# Altium schematic sheet ST_LINK_V2-1.SCHDOC: ST-LINK/V2-1 with support of SWD only
size A4; Date: 25-FEB-2015; Author: A.B; CompanyName: STMicroelectronics; Address1: 12, Rue Jules HOROWITZ; Address2: 38019 Grenoble; Address3: FRANCE; DocumentNumber: MB1191; Revision: B-02; SheetNumber: 2; SheetTotal: 13; Project: STM32F746G-DISCO
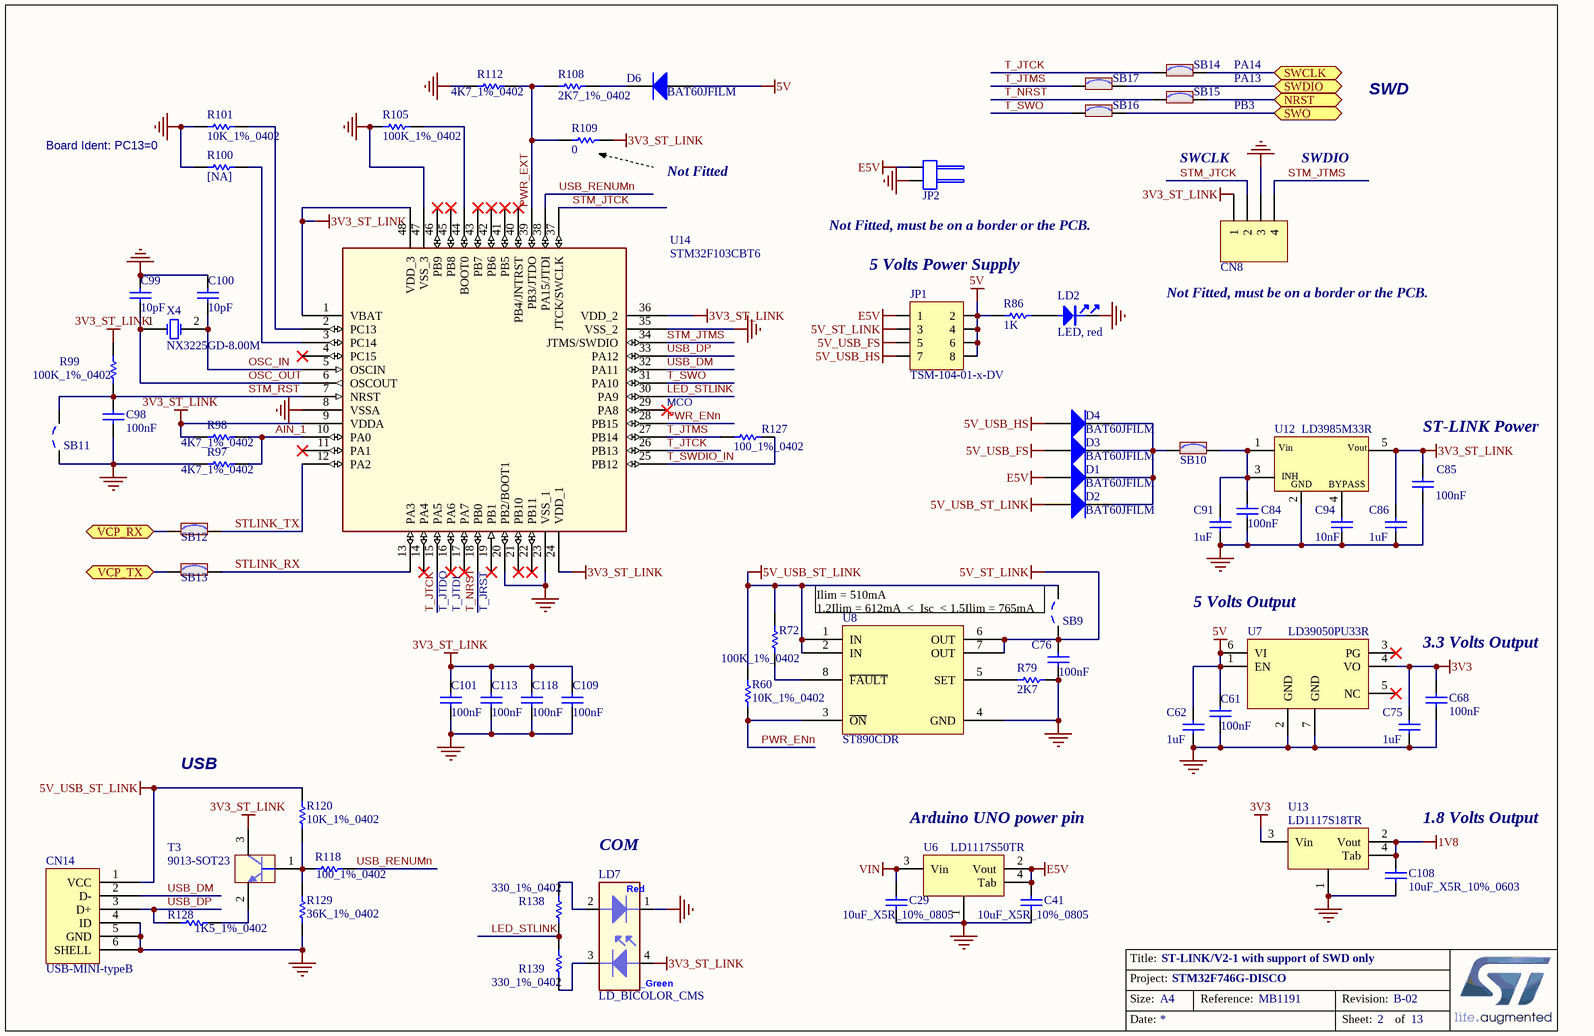
[diagram p0: ST_LINK_V2-1.SCHDOC]

## Parts
C29  10uF_X5R_10%_0805  [0805C]
C41  10uF_X5R_10%_0805  [0805C]
C61  100nF  [0402C]
C62  1uF  [0603C]
C68  100nF  [0402C]
C75  1uF  [0603C]
C76  100nF  [0402C]
C84  100nF  [0402C]
C85  100nF  [0402C]
C86  1uF  [0603C]
C91  1uF  [0603C]
C94  10nF  [0603C]
C98  100nF  [0402C]
C99  10pF  [0402C]
C100  10pF  [0402C]
C101  100nF  [0402C]
C108  10uF_X5R_10%_0603  [0603C]
C109  100nF  [0402C]
C113  100nF  [0402C]
C118  100nF  [0402C]
CN8  Header 4  [Header 4]  (value not drawn)
CN14  USB-MINI-typeB  [USB-MINI-B-SMD]
D1  BAT60JFILM  [SOD323/A]
D2  BAT60JFILM  [SOD323/A]
D3  BAT60JFILM  [SOD323/A]
D4  BAT60JFILM  [SOD323/A]
D6  BAT60JFILM  [SOD323/A]
JP1  TSM-104-01-x-DV  [TSM-104-01-x-DV]
JP2  TSM-102-01-x-SH  [SL_12_SMD_032_2]  (value not drawn)
LD2  LED, red  [0603D]
LD7  LD_BICOLOR_CMS  [HSMF-A201]
R60  10K_1%_0402  [0402R]
R72  100K_1%_0402  [0402R]
R79  2K7  [0402R]
R86  1K  [0402R]
R97  4K7_1%_0402  [0402R]
R98  4K7_1%_0402  [0402R]
R99  100K_1%_0402  [0402R]
R100  [NA]  [0402R]
R101  10K_1%_0402  [0402R]
R105  100K_1%_0402  [0402R]
R108  2K7_1%_0402  [0402R]
R109  0  [0402R]
R112  4K7_1%_0402  [0402R]
R118  100_1%_0402  [0402R]
R120  10K_1%_0402  [0402R]
R127  100_1%_0402  [0402R]
R128  1K5_1%_0402  [0402R]
R129  36K_1%_0402  [0402R]
R138  330_1%_0402  [0402R]
R139  330_1%_0402  [0402R]
SB9  Solder Bridge OFF  [JP2_SMD]  (value not drawn)
SB10  Solder Bridge ON  [JP2_SMD]  (value not drawn)
SB11  Solder Bridge OFF  [JP2_SMD]  (value not drawn)
SB12  Solder Bridge ON  [JP2_SMD]  (value not drawn)
SB13  Solder Bridge ON  [JP2_SMD]  (value not drawn)
SB14  Solder Bridge ON  [JP2_SMD]  (value not drawn)
SB15  Solder Bridge ON  [JP2_SMD]  (value not drawn)
SB16  Solder Bridge ON  [JP2_SMD]  (value not drawn)
SB17  Solder Bridge ON  [JP2_SMD]  (value not drawn)
T3  9013-SOT23  [SOT23]
U6  LD1117S50TR  [SOT-223]
U7  LD39050PU33R  [DFN6_3x3]
U8  ST890CDR  [SO-8]
U12  LD3985M33R  [SOT-23-5L]
U13  LD1117S18TR  [SOT-223]
U14  STM32F103CBT6  [QFP48 7x7]
X4  NX3225GD-8.00M  [XTAL_2SM_3R2X2R5]

## Ports
NRST, SWCLK, SWDIO, SWO, VCP_RX, VCP_TX

## Nets
1V8: C108.2 U13.2(Vout) U13.4(Tab)
3V3: C68.2 C75.2 U7.4(VO) U13.3(Vin)
3V3_ST_LINK: C85.2 C86.1 C101.2 C109.2 C113.2 C118.1 CN8.1 LD7.4 R98.1 R99.2 R109.2 T3.3(C) U12.5(Vout) U14.1(VBAT) U14.9(VDDA) U14.24(VDD_1) U14.36(VDD_2) U14.48(VDD_3)
5V: C61.2 C62.2 D6.1(A) JP1.2 JP1.4 JP1.6 JP1.8 R86.1 U7.1(EN) U7.6(VI)
5V_ST_LINK: C76.2 JP1.3 SB9.1 U8.6(OUT) U8.7(OUT)
5V_USB_FS: D3.1(A) JP1.5
5V_USB_HS: D4.1(A) JP1.7
5V_USB_ST_LINK: CN14.1(VCC) D2.1(A) R60.2 R72.2 R120.2 SB9.2 U8.1(IN) U8.2(IN)
E5V: C41.2 D1.1(A) JP1.1 JP2.1(COMMON) U6.2(Vout) U6.4(Tab)
GND: C29.1 C41.1 C61.1 C62.1 C68.1 C75.1 C76.1 C84.1 C85.1 C86.2 C91.1 C94.1 C98.1 C99.1 C100.1 C101.1 C108.1 C109.1 C113.1 C118.2 CN8.3 CN14.4(ID) CN14.5(GND) CN14.6(SHELL) JP2.2(NO) LD2.2 LD7.1 R79.2 R97.1 R100.1 R101.1 R105.1 R112.1 R129.1 SB11.1 U6.1 U7.2(GND) U7.7(GND) U8.4(GND) U12.2(GND) U13.1 U14.8(VSSA) U14.20(PB2/BOOT1) U14.23(VSS_1) U14.35(VSS_2) U14.47(VSS_3)
VIN: C29.2 U6.3(Vin)
AIN_1: R97.2 R98.2 U14.10(PA0)
LED_STLINK: R138.1 R139.2 U14.30(PA9)
NRST: SB15.2 ; port NRST
OSC_IN: C100.2 U14.5(OSCIN) X4.2(OSC2)
OSC_OUT: C99.2 U14.6(OSCOUT) X4.1(OSC1)
PWR_ENn: R60.1 U8.3(~{ON}) U14.28(PB15)
PWR_EXT: R108.1 R109.1 R112.2 U14.39(PB3/JTDO)
STLINK_RX: SB13.2 U14.13(PA3)
STLINK_TX: SB12.2 U14.12(PA2)
STM_JTCK: CN8.2 U14.37(JTCK/SWCLK)
STM_JTMS: CN8.4 U14.34(JTMS/SWDIO)
STM_RST: C98.2 R99.1 SB11.2 U14.7(NRST)
SWCLK: SB14.2 ; port SWCLK
SWDIO: SB17.2 ; port SWDIO
SWO: SB16.2 ; port SWO
T_JTCK: SB14.1 U14.15(PA5) U14.26(PB13)
T_JTMS: R127.1 SB17.1 U14.27(PB14)
T_NRST: SB15.1 U14.18(PB0)
T_SWDIO_IN: R127.2 U14.25(PB12)
T_SWO: SB16.1 U14.31(PA10)
USB_DM: CN14.2(D-) U14.32(PA11)
USB_DP: CN14.3(D+) R128.1 U14.33(PA12)
USB_RENUMn: R118.2 U14.38(PA15/JTDI)
VCP_RX: SB12.1 ; port VCP_RX
VCP_TX: SB13.1 ; port VCP_TX
NetC84_2: C84.2 C91.2 SB10.2 U12.1(Vin) U12.3(CE)
NetC94_2: C94.2 U12.4(BYPASS)
NetD1_2: D1.2(K) D2.2(K) D3.2(K) D4.2(K) SB10.1
NetD6_2: D6.2(K) R108.2
NetLD2_1: LD2.1 R86.2
NetLD7_2: LD7.2 R138.2
NetLD7_3: LD7.3 R139.1
NetR72_1: R72.1 U8.8(~{FAULT})
NetR79_1: R79.1 U8.5(SET)
NetR100_2: R100.2 U14.3(PC14)
NetR101_2: R101.2 U14.2(PC13)
NetR105_2: R105.2 U14.44(BOOT0)
NetR118_1: R118.1 R120.1 R129.2 T3.1(B)
NetR128_2: R128.2 T3.2(E)

Not connected (* = marked no-connect by the designer): U7 3(PG)* 5(NC)*; U14 4(PC15)* 11(PA1)* 14(PA4)* 16(PA6)* 17(PA7)* 19(PB1)* 21(PB10)* 22(PB11)* 29(PA8)* 40(PB4/JNTRST)* 41(PB5)* 42(PB6)* 43(PB7)* 45(PB8)* 46(PB9)*

## Notes on the sheet
- PA14
- PA13
- PB3
- SWD
- Board Ident: PC13=0
- Not Fitted
- SWCLK
- SWDIO
- (near JP2) Not Fitted, must be on a border or the PCB.
- 5 Volts Power Supply
- Not Fitted, must be on a border or the PCB.
- MCO
- ST-LINK Power
- (near U14) T_JTDO
- (near U14) T_JTDI
- (near U14) T_JRST
- (near SB9) Ilim = 510mA
  1.2Ilim = 612mA  <  Isc  < 1.5Ilim = 765mA
- 5 Volts Output
- 3.3 Volts Output
- USB
- COM
- (near U6) Arduino UNO power pin
- 1.8 Volts Output
- Title:
- Project:
- Size:
- Date:
- A4
- Reference:
- Sheet:
- Revision:
- of
- (in symbol LD3985M33R) INH
- (in symbol LD_BICOLOR_CMS) Red; _Green

## Library data of the parts
C29 C41 = Cap_10uF_X5R_10%_0805: Capacitor,10uF,25V,X5R,10%,0805,YAGEO; Manuf_Part_1: CC0805KRX5R8BB106; Revision: July-2002: Re-released for DXP Platform.; Value: 10uF; Order: CC0805KRX5R8BB106; Manuf_1: YAGEO; ECCN_US/EU: n/a
C61 C68 C76 C84 C85 C98 C101 C109 C113 C118 = Cap_100nF_X7R_10%_0402: Capacitor,100nF,16V,X7R,10%,0402,YAGEO; Manuf_Part_1: CC0402KRX7R7BB104; Revision: July-2002: Re-released for DXP Platform.; Value: 100nF; Order: CC0402KRX7R7BB104; Manuf_1: YAGEO
C62 C75 C86 C91 = Cap_1uF_X5R_10%_0603: Capacitor,1uF,16V,X5R,10%,0603,YAGEO; Manuf_Part_1: CC0603KRX5R7BB105; Revision: July-2002: Re-released for DXP Platform.; Value: 1uF; Order: CC0603KRX5R7BB105; Manuf_1: YAGEO
C94 = Cap_10nF_X7R_10%_0603: Capacitor,10nF,50V,X7R,10%,0603,YAGEO; Manuf_Part_1: CC0603KRX7R9BB103; Revision: July-2002: Re-released for DXP Platform.; Value: 10nF; Order: CC0603KRX7R9BB103; Manuf_1: YAGEO
C99 C100 = Cap_10pF_NPO_5%_0402: Capacitor,10pF,50V,NPO,5%,0402,YAGEO; Order: CC0402JRNPO9BN100; Revision: July-2002: Re-released for DXP Platform.; Value: 10pF; Manuf_1: YAGEO; Manuf_Part_1: CC0402JRNPO9BN100; ECCN_US/EU: n/a
C108 = Cap_10uF_X5R_10%_0603: Capacitor,10uF,6.3V,X5R,10%,0603,YAGEO; Manuf_Part_1: CC0603KRX5R5BB106; Revision: July-2002: Re-released for DXP Platform.; Value: 10uF; Order: CC0603KRX5R5BB106; Manuf_1: YAGEO; ECCN_US/EU: n/a
CN8 = Header 4: Header, 4-Pin; Fitted: NO; Revision: 17-Jul-2002: Re-released for DXP Platform.; Publisher: Altium Limited; ECCN_US/EU: n/a
CN14 = USB-MINI-typeB connector: Manuf_Part_1: 5075BMR-05-SM; Manuf_Part_2: 218205M1110T; Manuf_2: lyconn; Manuf_Part_3: MUSB5QS-BM1H6-NLB-E; Manuf_3: TOWNES; Description: USB,MINI-USB-5P/F, 5075BMR-05-M; ECCN_US/EU: n/a
D1-D4 D6 = BAT60JFILM: Manuf_1: STM; Provided: ST; ECCN_US/EU: EAR99/NEC; Ref St: 9151097; Revision: July-2002: Re-released for DXP Platform.; Order: BAT60JFILM; Manuf_Part_1: BAT60JFILM; Distrib: ST
JP1 = Header_4X2_SMD: Header, 4-Pins, Double row Vertical, SMD, 2.54; Manuf_1: SAMTEC; Manuf_Part_1: TSM-104-01-x-DV; ECCN_US/EU: n/a
JP2 = JP2_CMS: Header, 2-Pins, Single row Horizontal SMD, 2.54; Manuf_1: SAMTEC; Manuf_Part_2: SL 12 SMD 032 2 Z B TR; Manuf_2: Fisher Elektronik; Manuf_Part_3: P1014-1*02VGF-129-1A; Manuf_3: TOWNES; ECCN_US/EU: n/a; Manuf_Part_1: TSM-102-01-x-SH
LD2 = LED_red: LED, red, 0603; Manuf_1: everlight; Manuf_Part_1: 19-213-R6C-AP1Q2B/3T; Description: LED,red,0603,19-213-R6C-AP1Q2B/3T,everlight; ECCN_US/EU: EAR99/NEC; Order: 19-213-R6C-AP1Q2B/3T
LD7 = LD_BICOLOR_CMS: Bicolor Led; Manuf_Part_1: HSMF-A201-A00J1; Manuf_1: Avago Technologies; Manuf_2: everluck; Manuf_Part_2: LE-RGW35280; Ref St: xxxxxx; ECCN_US/EU: EAR99/NEC; Distrib: RADIOSPARES
R60 R101 R120 = Res_10K_1%_0402: Resistor,10K,0402,1%,YAGEO; Manuf_Part_1: RC0402FR-0710KL; Value: 10K; Manuf_1: YAGEO; Order: RC0402FR-0710KL; ECCN_US/EU: n/a
R72 R99 R105 = Res_100K_1%_0402: Resistor,100K,0402,1%,YAGEO; Manuf_Part_1: RT0402FRE07100KL; Value: 100K; Manuf_1: YAGEO; Order: RT0402FRE07100KL; ECCN_US/EU: n/a
R79 R108 = Res_2K7_1%_0402: Resistor,2K7,0402,1%,YAGEO; Manuf_Part_1: RC0402FR-072K7L; Value: 2K7; Manuf_1: YAGEO; Order: RC0402FR-072K7L; ECCN_US/EU: n/a; Distrib: FARNELL
R86 = Res_1K_1%_0402: Resistor,1K,0402,1%,YAGEO; Manuf_Part_1: RC0402FR-071KL; Value: 1K; Manuf_1: YAGEO; Order: RC0402FR-071KL; ECCN_US/EU: n/a
R97 R98 R112 = Res_4K7_1%_0402: Resistor,4K7,0402,1%,YAGEO; Manuf_Part_1: RT0402FRE074K7L; Value: 4K7; Manuf_1: YAGEO; Order: RT0402FRE074K7L; ECCN_US/EU: n/a
R100 = Res_NA_0402: Resistor,[NA],0402; Fitted: NO; Value: [NA]; ECCN_US/EU: n/a
R109 = Res_0_5%_0402: Resistor,0,0402,5%,YAGEO; Manuf_Part_1: RC0402JR-070RL; Order: 2363467; Fitted: NO; Value: 0; ECCN_US/EU: n/a; Manuf_1: YAGEO; Distrib: FARNELL
R118 R127 = Res_100_1%_0402: Resistor,100,0402,1%,YAGEO; Manuf_Part_1: RC0402FR-07100RL; Value: 100; Order: 9239111; Manuf_1: YAGEO; ECCN_US/EU: n/a; Distrib: FARNELL
R128 = Res_1K5_1%_0402: Resistor,1K5,0402,1%,YAGEO; Manuf_Part_1: RC0402FR-071K5L; Value: 1K5; Manuf_1: YAGEO; Order: RC0402FR-071K5L; ECCN_US/EU: n/a; Distrib: FARNELL
R129 = Res_36K_1%_0402: Resistor,36K,0402,1%,YAGEO; Manuf_Part_1: RC0402FR-0736KL; Value: 36K; Manuf_1: YAGEO; Order: RC0402FR-0736KL; ECCN_US/EU: n/a; Distrib: FARNELL
R138 R139 = Res_330_1%_0402: Resistor,330,0402,1%,YAGEO; Manuf_Part_1: RC0402FR-07330RL; Value: 330; ECCN_US/EU: n/a; Manuf_1: YAGEO; Distrib: DIGIKEY; Order: RC0402FR-07330RL
SB9 SB11 = SB_OFF: Solder: NO; Revision: July-2002: Re-released for DXP Platform.; ECCN_US/EU: n/a
SB10 SB12-SB17 = SB_ON: Solder: YES; Revision: July-2002: Re-released for DXP Platform.; ECCN_US/EU: n/a
T3 = 9013-SOT23: NPN Bipolar Transistor; Manuf_1: NXP; Manuf_Part_1: BSR14; Description: NPN Bipolar Transistor, SOT-23 Footprint; Order: 1081310; ECCN_US/EU: EAR99/NEC; Revision: July-2002: Re-released for DXP Platform.; Distrib: FARNELL
U6 = LD1117S50TR: IC REG LDO 5V 0.8A SOT223; Manuf_1: STM; Ordered by: ST; ECCN_US/EU: EAR99/NEC; Ref St: 9176133; Manuf_Part_1: LD1117S50TR; Distrib: ST; Order: LD1117S50TR; Provided: ST
U7 = LD39050P: Ultra low drop-low , 500 mA low quiescent current; Manuf_1: STM; Provided: ST; ECCN_US/EU: EAR99/NEC; Ref St: xxxxxxxx; Distrib: ST; Manuf_Part_1: LD39050PU33R; Order: LD39050PU33R
U8 = ST890CDR: 1.2 A current limited high-side power switch with thermal shutdown; Manuf_1: STM; ECCN_US/EU: EAR99/NEC; Provided: ST; Manuf_Part_1: ST890CDR; Distrib: ST
U12 = LD3985M33R: Ultra low drop-low noise BiCMOS voltage, regulators low ESR capacitors compatible; Manuf_1: STM; Provided: ST; Ref St: 9176161; ECCN_US/EU: EAR99/NEC; Manuf_Part_1: LD3985M33R; Distrib: ST; Order: LD3985M33R
U13 = LD1117S18TR: LOW DROP FIXED AND ADJUSTABLE POSITIVE VOLTAGE REGULATORS (1.8 Volts); Manuf_1: STM; Ref St: 9176180; ECCN_US/EU: EAR99/NEC; Provided: ST; Manuf_Part_1: LD1117S18TR; Order: LD1117S18TR; Distrib: ST
U14 = STM32F103CBT6: Medium-density performance line ARM-based 32-bit MCU with 128KB Flash; Manuf_1: STM; Ref St: xxxxxxxx; Provided: ST; ECCN_US/EU: 3A991A2/NEC; Footprint: QFP48 7X7; Manuf_Part_1: STM32F103CBT6; Order: STM32F103CBT6; Distrib: ST
X4 = XTAL_8M_NX3225GD: Crystal 8Mhz, 8pF, -+50PPM, SMD; Manuf_1: NDK; Manuf_Part_1: NX3225GD 8MHz EXS00A-CG04874; Manuf_Part_2: NX3225GD-8.000M-STD-CRA-3; ECCN_US/EU: EAR99/NEC; NDK Ref: X3127326; Ref St: 9157029; Provided: ST; Order: NX3225GD 8MHz EXS00A-CG04874